# EAGLE design T245Controller_rev1 (EAGLE 9.6.1)

## Sheet 1 of 2
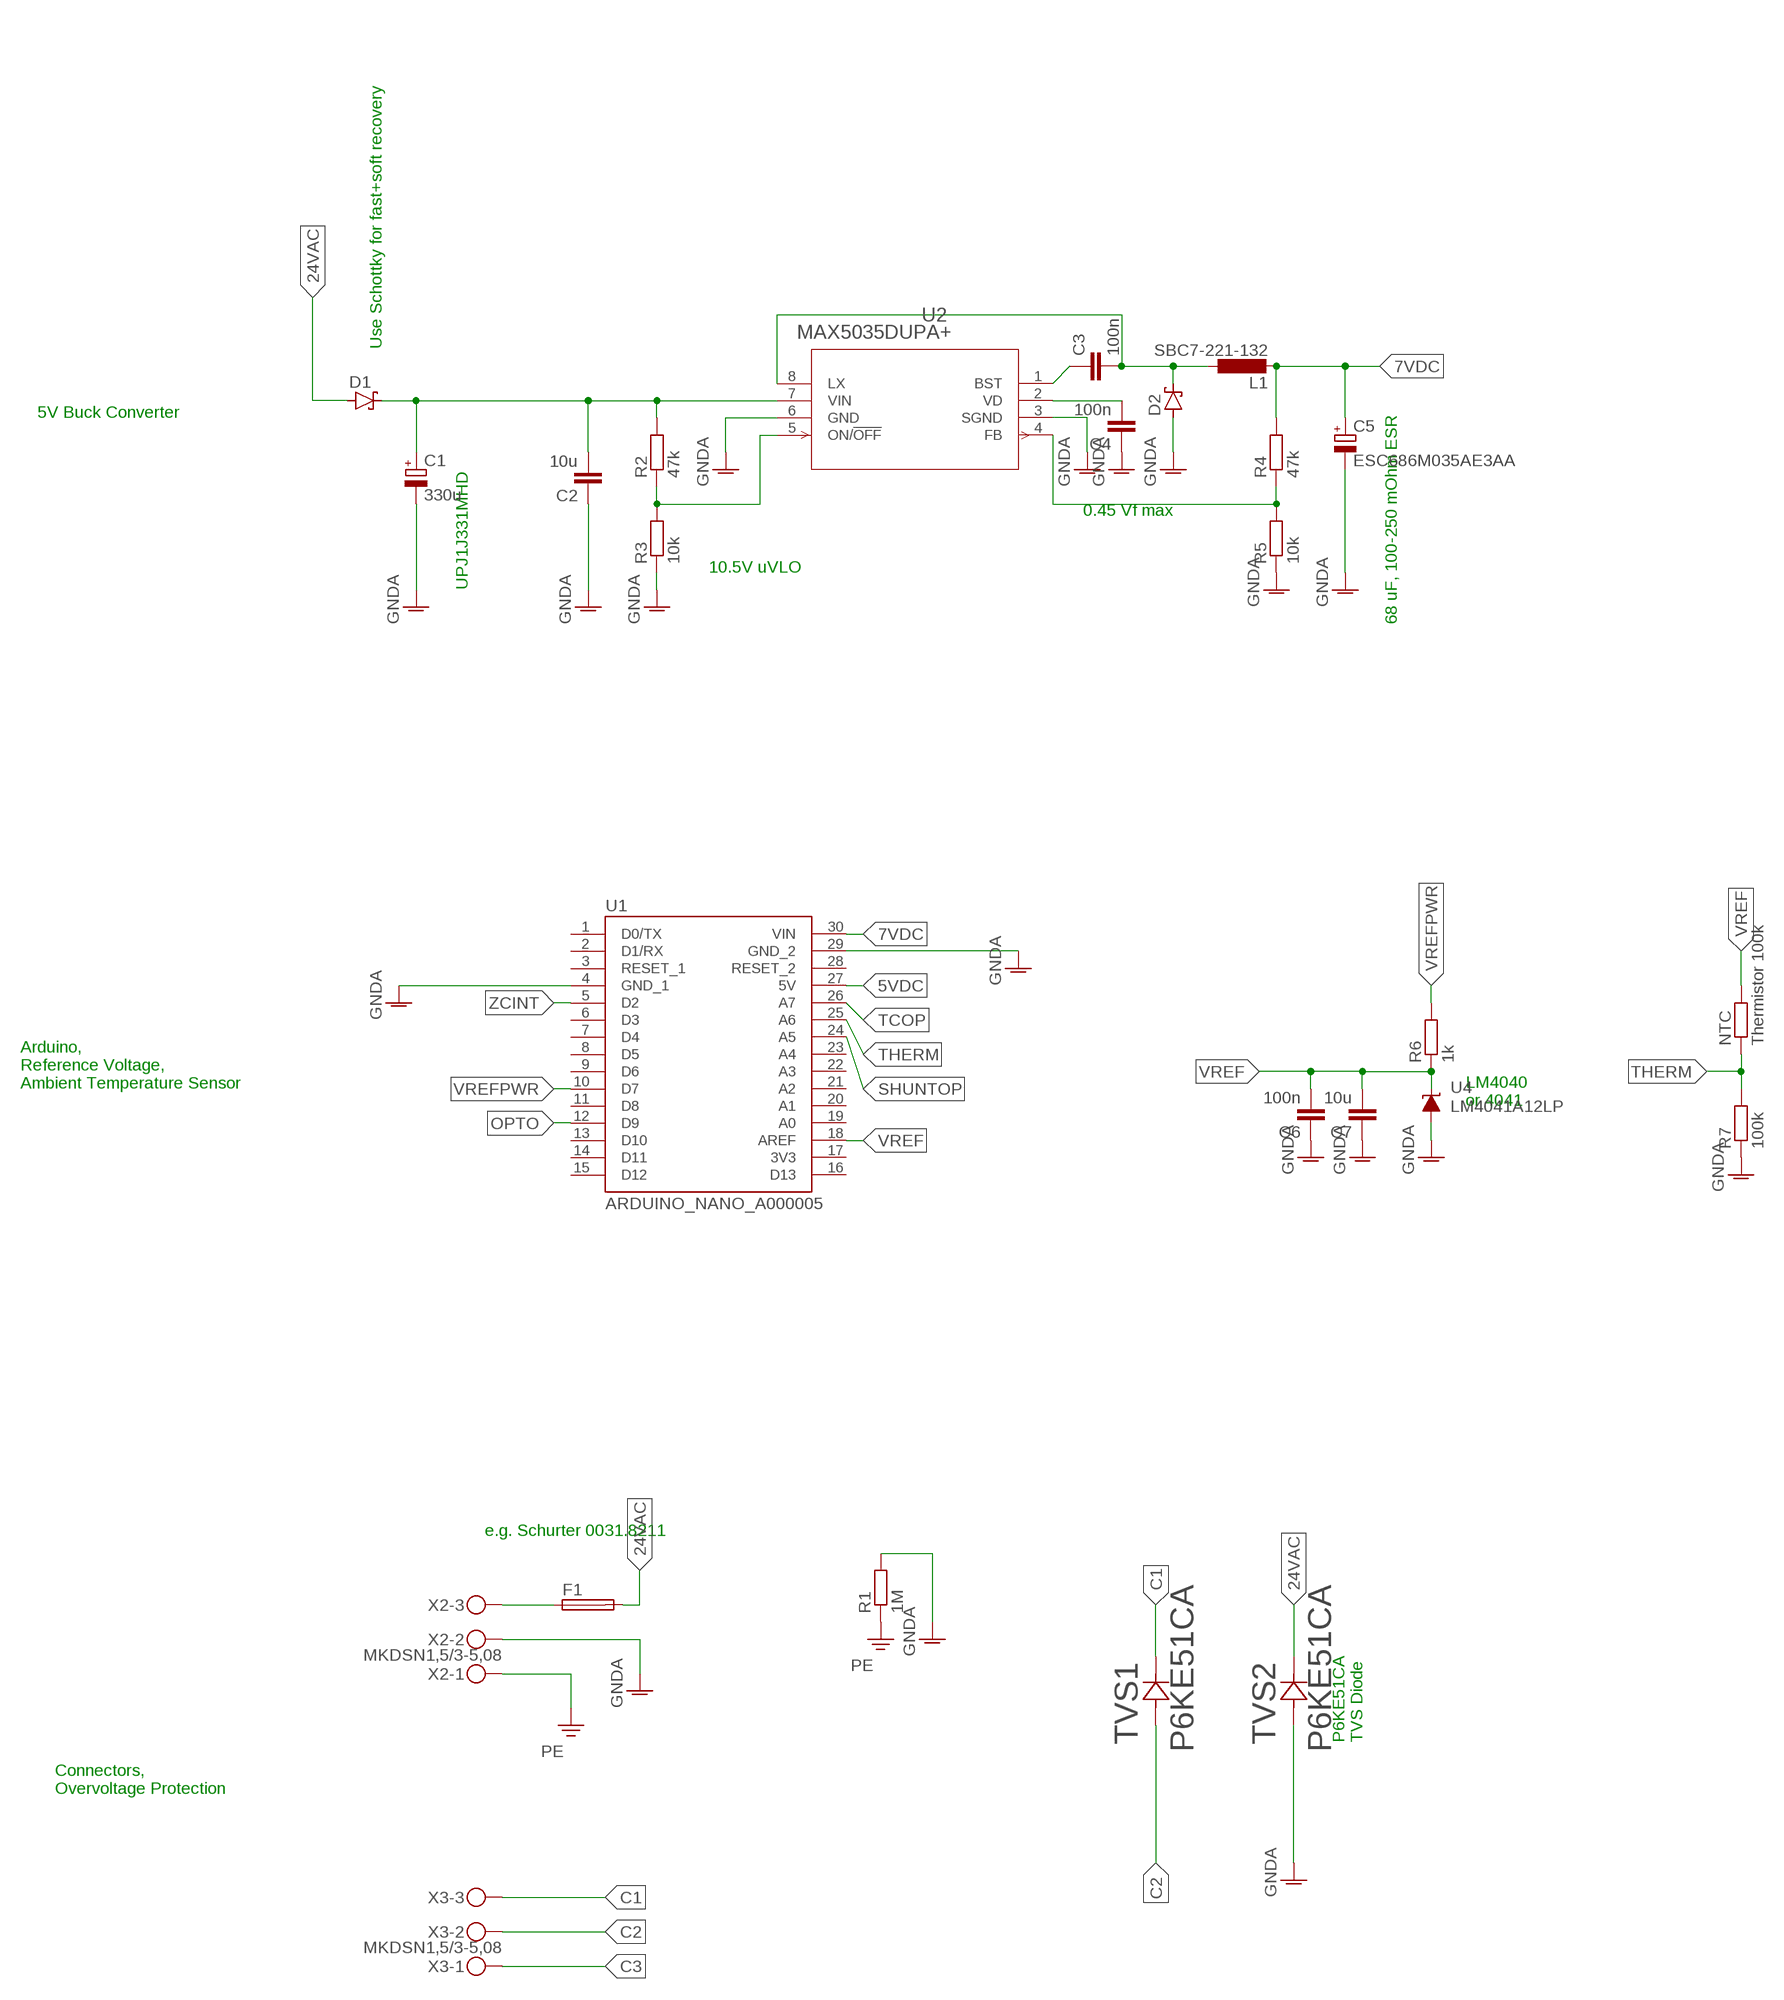
[diagram p0: schematic, sheet 1, part 1 of 2]
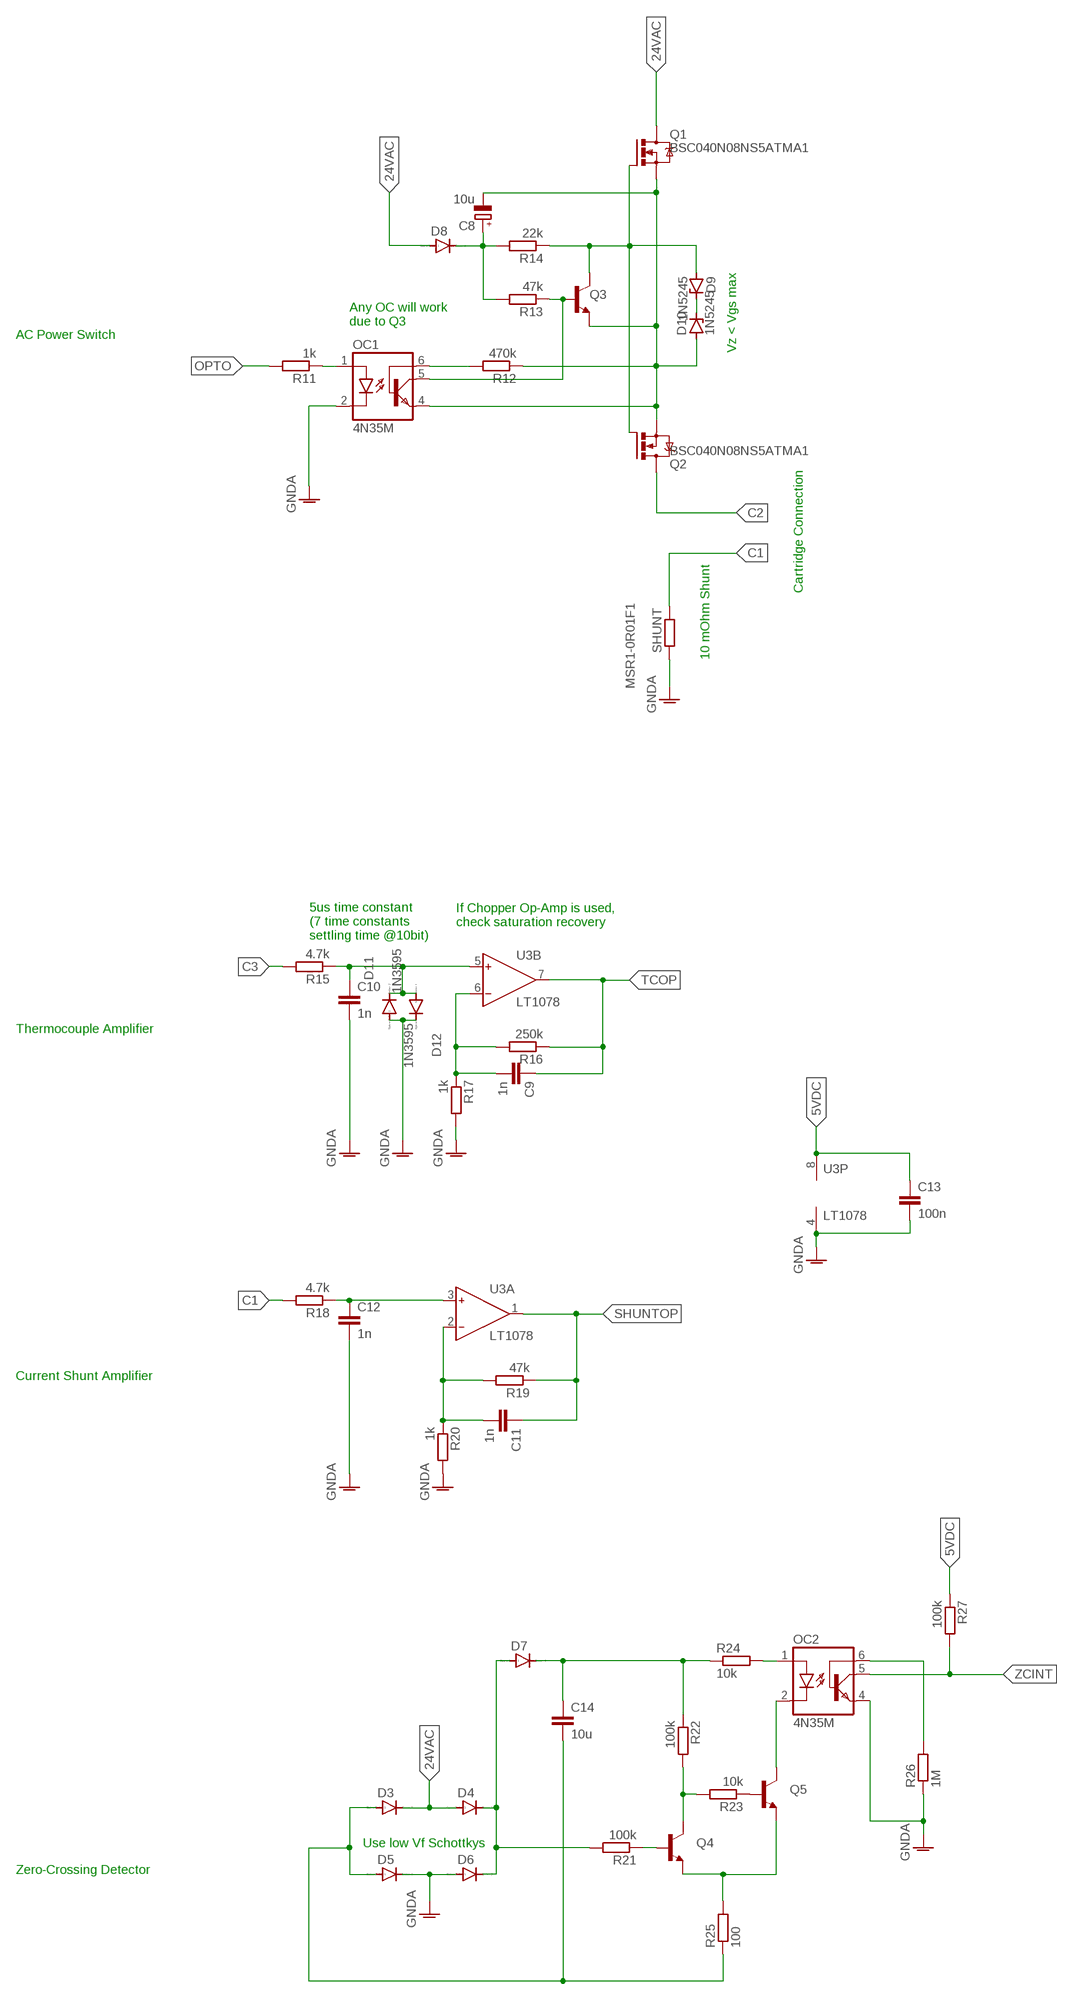
[diagram p1: schematic, sheet 1, part 2 of 2]

### Parts
C1  330u  CPOL-EUE5-13  [E5-13]
C2  10u  C-EU050-024X044  [C050-024X044]
C3  100n  C-EU050-024X044  [C050-024X044]
C4  100n  C-EU050-024X044  [C050-024X044]
C5  ESC686M035AE3AA  CPOL-EUE2.5-6  [E2,5-6]
C6  100n  C-EU050-024X044  [C050-024X044]
C7  10u  C-EU050-024X044  [C050-024X044]
C8  10u  CPOL-EUE2.5-6  [E2,5-6]
C9  1n  C-EU050-024X044  [C050-024X044]
C10  1n  C-EU050-024X044  [C050-024X044]
C11  1n  C-EU050-024X044  [C050-024X044]
C12  1n  C-EU050-024X044  [C050-024X044]
C13  100n  C-EU050-024X044  [C050-024X044]
C14  10u  C-EU050-024X044  [C050-024X044]
D1  SCHOTTKY-DIODEF126Z12  [F126Z12]
D2  SCHOTTKY-DIODEF126Z12  [F126Z12]
D3  DIODE-D-7.5  [D-7.5]
D4  DIODE-D-7.5  [D-7.5]
D5  DIODE-D-7.5  [D-7.5]
D6  DIODE-D-7.5  [D-7.5]
D7  DIODE-D-7.5  [D-7.5]
D8  DIODE-D-7.5  [D-7.5]
D9  1N5245  ZENER-DIODEDO41Z10  [DO41Z10]
D10  1N5245  ZENER-DIODEDO41Z10  [DO41Z10]
D11  1N3595  DIODE-D-7.5  [D-7.5]
D12  1N3595  DIODE-D-7.5  [D-7.5]
F1  SH22,5A  [SH22,5A]
L1  SBC7-221-132  L-EU0207/10  [0207/10]
NTC  Thermistor 100k  R-EU_0207/10  [0207/10]
OC1  4N35M  [DIL06]
OC2  4N35M  [DIL06]
Q1  BSC040N08NS5ATMA1  IRF540  [TO220BV]
Q2  BSC040N08NS5ATMA1  IRF540  [TO220BV]
Q3  2N5550-NPN-TO92-EBC  [TO92-EBC]
Q4  2N5550-NPN-TO92-EBC  [TO92-EBC]
Q5  2N5550-NPN-TO92-EBC  [TO92-EBC]
R1  1M  R-EU_0207/10  [0207/10]
R2  47k  R-EU_0207/10  [0207/10]
R3  10k  R-EU_0207/10  [0207/10]
R4  47k  R-EU_0207/10  [0207/10]
R5  10k  R-EU_0207/10  [0207/10]
R6  1k  R-EU_0207/10  [0207/10]
R7  100k  R-EU_0207/10  [0207/10]
R11  1k  R-EU_0207/10  [0207/10]
R12  470k  R-EU_0207/10  [0207/10]
R13  47k  R-EU_0207/10  [0207/10]
R14  22k  R-EU_0207/10  [0207/10]
R15  4.7k  R-EU_0207/10  [0207/10]
R16  250k  R-EU_0207/10  [0207/10]
R17  1k  R-EU_0207/10  [0207/10]
R18  4.7k  R-EU_0207/10  [0207/10]
R19  47k  R-EU_0207/10  [0207/10]
R20  1k  R-EU_0207/10  [0207/10]
R21  100k  R-EU_0207/10  [0207/10]
R22  100k  R-EU_0207/10  [0207/10]
R23  10k  R-EU_0207/10  [0207/10]
R24  10k  R-EU_0207/10  [0207/10]
R25  100  R-EU_0207/10  [0207/10]
R26  1M  R-EU_0207/10  [0207/10]
R27  100k  R-EU_0207/10  [0207/10]
SHUNT  MSR1-0R01F1  R-EU_0207/12  [0207/12]
TVS1  P6KE51CA  [P6KESERIES_LTF]
TVS2  P6KE51CA  [P6KESERIES_LTF]
U1  ARDUINO_NANO_A000005  [MODULE_A000005]
U2  MAX5035DUPA+  [21-0043_P8+3_MXM]
U3  LT1078  AD8066N  [DIL08]
U4  LM4041A12LP  [LP_O-PBCY-W3]
X2  MKDSN1,5/3-5,08  [MKDSN1,5/3-5,08]
X3  MKDSN1,5/3-5,08  [MKDSN1,5/3-5,08]

### Nets
5VDC: C13.1 R27.1 U1.27(5V) U3.8(P:V+)
7VDC: C5.+ L1.2 R4.2 U1.30(VIN)
24VAC: D1.A D3.C D4.A D8.A F1.2 Q1.D TVS2.1
C1: R18.2 SHUNT.2 TVS1.1 X3.3
C2: Q2.D TVS1.2 X3.2
C3: R15.2 X3.1
GNDA: C1.- C2.1 C4.1 C5.- C6.1 C7.1 C10.2 C12.2 C13.2 D2.A D5.C D6.A D11.A D12.C OC1.2(C) OC2.4(EMI) R1.2 R3.1 R5.1 R7.1 R17.2 R20.2 R26.1 SHUNT.1 TVS2.2 U1.4(GND_1) U1.29(GND_2) U2.3(SGND) U2.6(GND) U3.4(P:V-) U4.3(A) X2.2
N$1: C9.2 R16.2 R17.1 U3.6(B:IN-)
N$2: OC1.1(A) R11.1
N$3: D9.A Q1.G Q2.G Q3.C R14.1
N$4: C8.- D10.A OC1.4(EMI) Q1.S Q2.S Q3.E R12.1
N$5: OC1.6(BAS) R12.2
N$6: Q5.B R23.1
N$7: R4.1 R5.2 U2.4(FB)
N$8: C3.2 D2.C L1.1 U2.8(LX)
N$9: C8.+ D8.C R13.2 R14.2
N$10: C1.+ C2.2 D1.C R2.2 U2.7(VIN)
N$11: C10.1 D11.C D12.A R15.1 U3.5(B:IN+)
N$12: C3.1 U2.1(BST)
N$13: OC1.5(COL) Q3.B R13.1
N$16: D9.C D10.C
N$17: R2.1 R3.2 U2.5(ON/!OFF)
N$18: C4.2 U2.2(VD)
N$21: C14.2 D3.A D5.A R25.1
N$22: OC2.6(BAS) R26.2
N$24: F1.1 X2.3
N$25: C12.1 R18.1 U3.3(A:IN+)
N$26: D4.C D6.C D7.A R21.2
N$27: C11.2 R19.2 R20.1 U3.2(A:IN-)
N$28: Q4.B R21.1
N$29: C14.1 D7.C R22.1 R24.1
N$30: Q4.C R22.2 R23.2
N$31: Q4.E Q5.E R25.2
N$32: OC2.1(A) R24.2
N$33: OC2.2(C) Q5.C
OPTO: R11.2 U1.12(D9)
PE: R1.1 X2.1
SHUNTOP: C11.1 R19.1 U1.24(A5) U3.1(A:OUT)
TCOP: C9.1 R16.1 U1.26(A7) U3.7(B:OUT)
THERM: NTC.1 R7.2 U1.25(A6)
VREF: C6.2 C7.2 NTC.2 R6.1 U1.18(AREF) U4.2(C)
VREFPWR: R6.2 U1.10(D7)
ZCINT: OC2.5(COL) R27.2 U1.5(D2)
Unconnected: U1.1(D0/TX) U1.2(D1/RX) U1.3(RESET_1) U1.6(D3) U1.7(D4) U1.8(D5) U1.9(D6) U1.11(D8) U1.13(D10) U1.14(D11) U1.15(D12) U1.16(D13) U1.19(A0) U1.20(A1) U1.21(A2) U1.22(A3) U1.23(A4) U1.28(RESET_2)

### Notes on the sheet
- Use Schottky for fast+soft recovery
- 5V Buck Converter
- 0.45 Vf max
- 10.5V uVLO
- UPJ1J331MHD
- 68 uF, 100-250 mOhm ESR
- Arduino,
  Reference Voltage,
  Ambient Temperature Sensor
- LM4040
  or 4041
- e.g. Schurter 0031.8211
- P6KE51CA
  TVS Diode
- Connectors,
  Overvoltage Protection
- Any OC will work
  due to Q3
- AC Power Switch
- Vz < Vgs max
- Cartridge Connection
- 10 mOhm Shunt
- If Chopper Op-Amp is used,
  check saturation recovery
- 5us time constant
  (7 time constants 
  settling time @10bit)
- Thermocouple Amplifier
- Current Shunt Amplifier
- Use low Vf Schottkys
- Zero-Crossing Detector

## Sheet 2 of 2

## Power pins joined to a net without a drawn wire
3V3: U1.17(3V3)

## Library data of the parts
C1 C5 C8 = rcl:CPOL-EU: POLARIZED CAPACITOR, European symbol; SPICEPREFIX: C
C2-C4 C6 C7 C9-C14 = rcl:C-EU: CAPACITOR, European symbol; SPICEPREFIX: C
D1 D2 = diode:SCHOTTKY-DIODE: Schottky Diode
D3-D8 D11 D12 = diode:DIODE-: DIODE
D9 D10 = diode:ZENER-DIODE: Z-Diode
F1 = fuse:SH22,5A: FUSE HOLDER grid 22,5mm, isolated cap OGN0031 8201, Schurter (Buerklin); MPN: 0031.7701.11; OC_FARNELL: unknown; OC_NEWARK: 04F1224
L1 = rcl:L-EU: INDUCTOR, European symbol; SPICEPREFIX: L
NTC R1-R7 R11-R27 SHUNT = rcl:R-EU_: RESISTOR, European symbol; SPICEPREFIX: R
OC1 OC2 = optocoupler:4N*?M: General Purpose 6-Pin Phototransistor Optocouplers Source: http://www.fairchildsemi.com/ds/4N/4N35-M.pdf; MPN: 4N35-M; OC_FARNELL: 1021351; OC_NEWARK: 98K9114
Q1 Q2 = transistor-power:IRF540: HEXFET Power MOSFET
Q3-Q5 = transistor-neu-to92:*-NPN-: NPN Transistror
TVS1 TVS2 = P6KE51CA:P6KE51CA; BUILT_BY: EMA_UL_Team; MANUFACTURER_PART_NUMBER: P6KE51CA; SOURCELIBRARY: LittleFuse_2015-04-13; VENDOR: Littelfuse Inc
U1 = Arduino_Nano_A000005:ARDUINO_NANO_A000005; AVAILABILITY: In Stock; DESCRIPTION: ATmega328 Arduino Nano AVR® ATmega AVR MCU 8-Bit Embedded Evaluation Board; MF: Arduino; MP: A000005; PACKAGE: None; PRICE: None
U2 = MAX5035-DUPA:MAX5035DUPA+; BUILT_BY: EMA_UL_Team; MANUFACTURER_PART_NUMBER: max5035dupa+; REVISION: 1; SOURCELIBRARY: Update_to_database_2021-03-24; VENDOR: Maxim Integrated Products
U3 = analog-devices:AD8066: High Performance, 145 MHz FastFET Op Amps Source: http://www.analog.com/static/imported-files/data_sheets/AD8065_8066.pdf; OC_FARNELL: unknown; OC_NEWARK: unknown
U4 = texas:LM4041: PRECISION MICROPOWER SHUNT VOLTAGE REFERENCE Source: http://focus.ti.com/lit/ds/slcs146e/slcs146e.pdf; OC_FARNELL: 9486119; OC_NEWARK: unknown
X2 X3 = con-phoenix-508:MKDSN1,5/3-5,08: MKDSN 1,5/ 3-5,08 Printklemme Nennstrom: 13,5 A Nennspannung: 250 V Rastermaß: 5,08 mm Polzahl: 3 Anschlussart: Schraubanschluss Montage: Löten Anschlussrichtung Leiter/Platine: 0 ° Artikelnummer: 1729131 Source: http://eshop.phoenixcontact.com .. 1729131.pdf

## Board
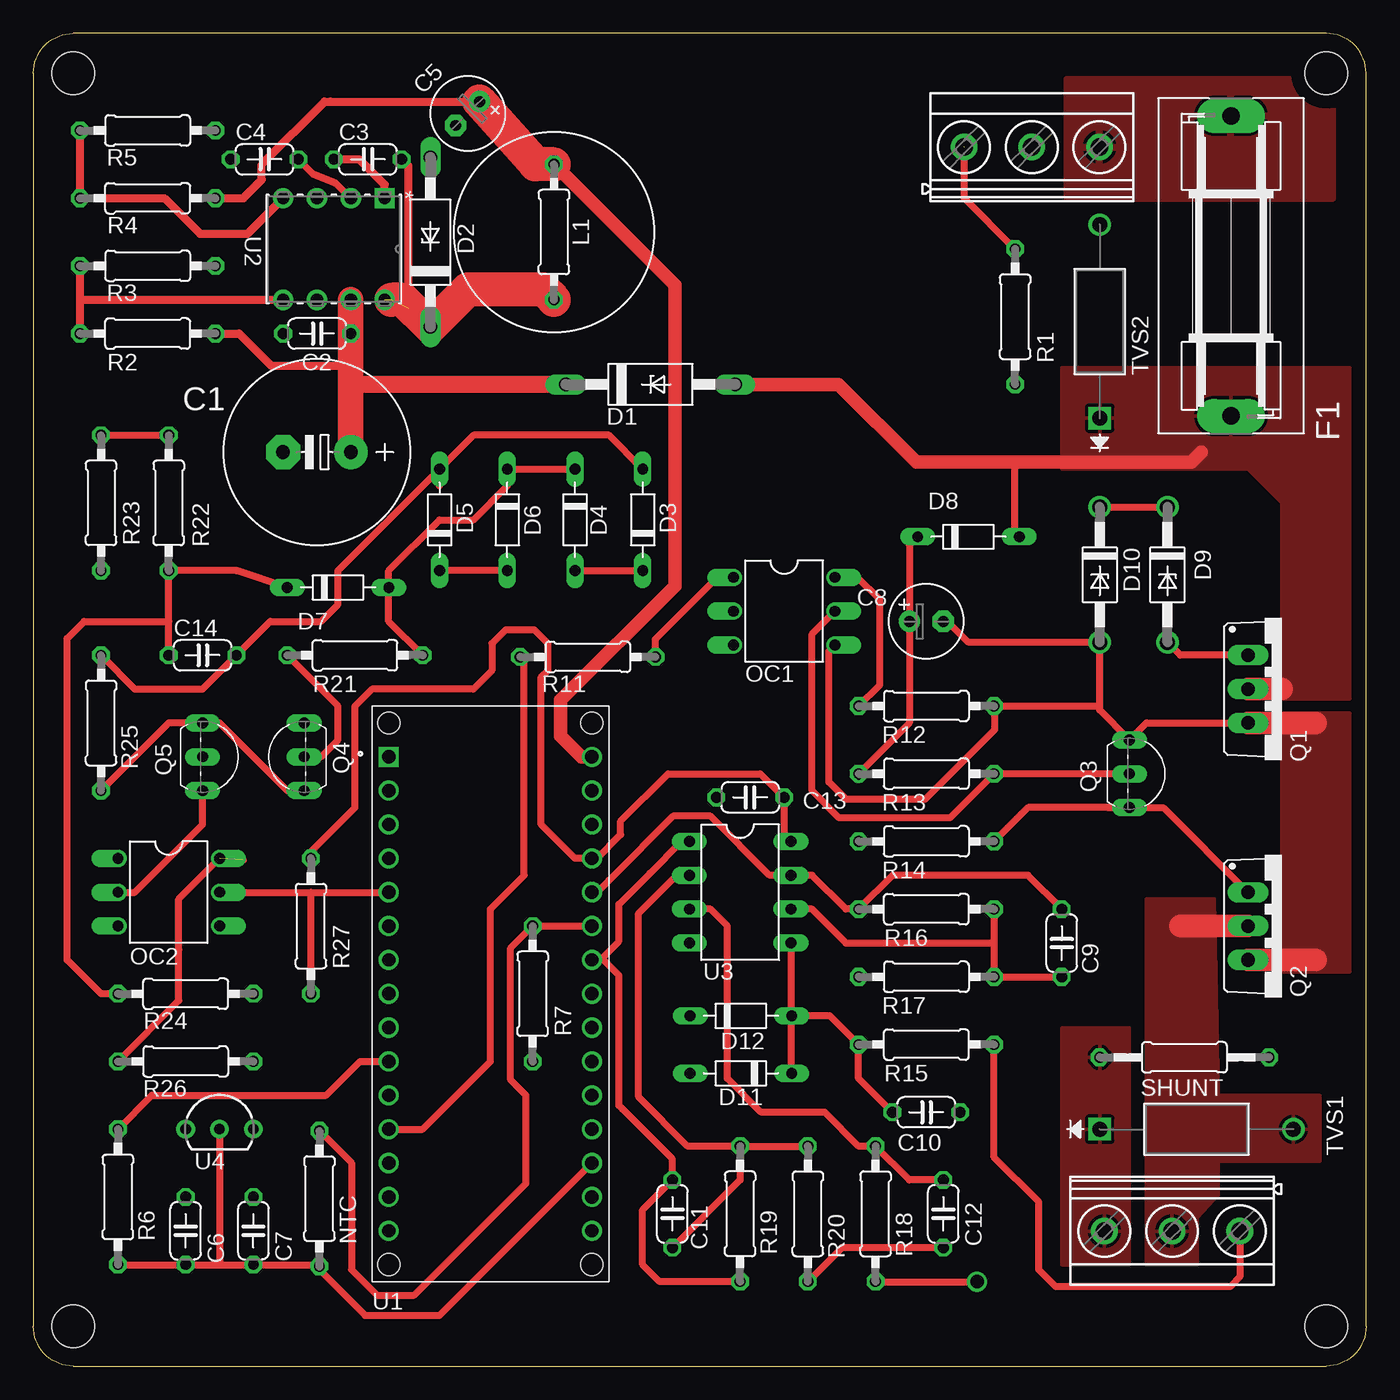
[diagram p2: board, top side]
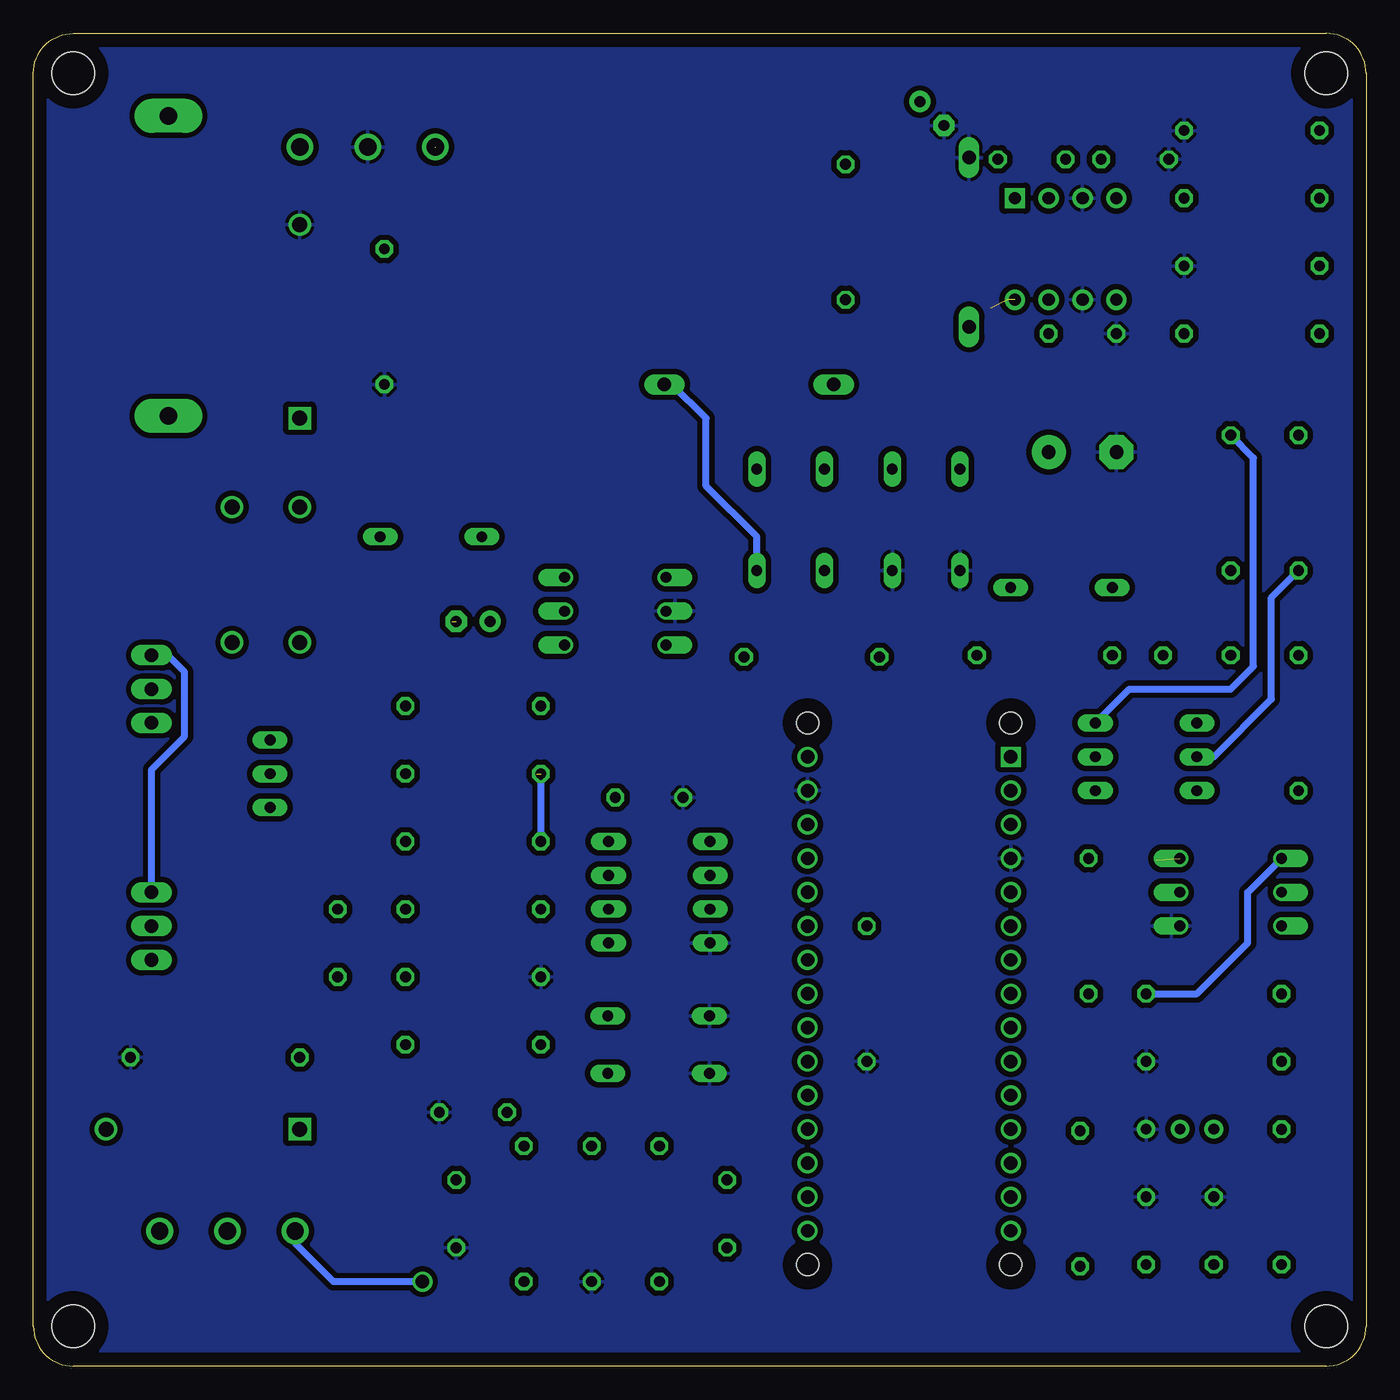
[diagram p3: board, bottom side, seen from below]

Size 100 x 100 mm. Coordinates in mm from the lower left corner, seen from the top.
Outline: 3,0 97,0 arc90 100,3 100,97 arc90 97,100 3,100 arc90 0,97 0,3 arc90 3,0
Copper layers (1*16): Top 0.035mm / dielectric 1.5mm / Bottom 0.035mm
Design rules "default *": minimum track width 6mil, minimum drill 0.35mm, track to track 16mil, track to pad 16mil, pad to pad 16mil, via to via 16mil, smd to smd 16mil, copper to edge 40mil, drill to drill 6mil, minimum pad ring 10mil, minimum via ring 8mil, stop-mask expansion 4mil, vias tented up to drill 0mil, thermal gap 10mil
Holes 3.2 mm at 3,97 3,3 97,97 97,3

### Footprints (pad centres in the part's own frame; a part is rotated, then mirrored left to right if it is on the bottom)
E5-13 = drill 1.016 pad 2.54: + -2.54,0 | drill 1.016 pad 2.54 octagon: - 2.54,0
C050-024X044 = drill 0.813 octagon: 1 -2.54,0; 2 2.54,0
E2,5-6 = drill 0.813 pad 1.6: + -1.27,0 | drill 0.813 pad 1.6 octagon: - 1.27,0
F126Z12 = drill 1.016 long: A 6.35,0; C -6.35,0
D-7.5 = drill 0.813 long: A 3.81,0; C -3.81,0
DO41Z10 = drill 1.118: A 5.08,0; C -5.08,0
SH22,5A = drill 1.321 pad 2.54 long: 1 -11.252,0; 2 11.252,0
0207/10 = drill 0.813 octagon: 1 -5.08,0; 2 5.08,0
DIL06 = drill 0.813 offset: 1 -2.54,-3.81; 2 0,-3.81; 3 2.54,-3.81; 4 2.54,3.81; 5 0,3.81; 6 -2.54,3.81
TO220BV = drill 1.016 long: D 0,-2.54; G -2.54,-2.54; S 2.54,-2.54
TO92-EBC = drill 0.813 long: B 0,-1.27; C 2.54,-1.27; E -2.54,-1.27
0207/12 = drill 0.813 octagon: 1 -6.35,0; 2 6.35,0
P6KESERIES_LTF = drill 1.118 pad 1.626 square: 1 0,0 | drill 1.118 pad 1.626: 2 14.529,0
MODULE_A000005 = drill 1 square: 1 -7.62,17.78 | drill 1: 2 -7.62,15.24; 3 -7.62,12.7; 4 -7.62,10.16; 5 -7.62,7.62; 6 -7.62,5.08; 7 -7.62,2.54; 8 -7.62,0; 9 -7.62,-2.54; 10 -7.62,-5.08; 11 -7.62,-7.62; 12 -7.62,-10.16; 13 -7.62,-12.7; 14 -7.62,-15.24; 15 -7.62,-17.78; 16 7.62,-17.78; 17 7.62,-15.24; 18 7.62,-12.7; 19 7.62,-10.16; 20 7.62,-7.62; 21 7.62,-5.08; 22 7.62,-2.54; 23 7.62,0; 24 7.62,2.54; 25 7.62,5.08; 26 7.62,7.62; 27 7.62,10.16; 28 7.62,12.7; 29 7.62,15.24; 30 7.62,17.78 | hole 1.651: -7.62,-20.32; 7.62,-20.32; -7.62,20.32; 7.62,20.32
21-0043_P8+3_MXM = drill 0.914 pad 1.524 square: 1 0,0 | drill 0.914 pad 1.524: 2 0,-2.54; 3 0,-5.08; 4 0,-7.62; 5 7.62,-7.62; 6 7.62,-5.08; 7 7.62,-2.54; 8 7.62,0
DIL08 = drill 0.813 long: 1 -3.81,-3.81; 2 -1.27,-3.81; 3 1.27,-3.81; 4 3.81,-3.81; 5 3.81,3.81; 6 1.27,3.81; 7 -1.27,3.81; 8 -3.81,3.81
LP_O-PBCY-W3 = drill 0.8 pad 1.4: 1 -2.54,0; 2 0,0; 3 2.54,0
MKDSN1,5/3-5,08 = drill 1.3 pad 2: 1 -7.641,0.025; 2 -2.561,0.025; 3 2.519,0.025

### Placement (x,y rotation side)
C1  21.28,68.58 180 top
C2  21.28,77.47 0 top
C3  25.09,90.55 0 top
C4  17.34,90.55 0 top
C5  32.58,93.98 225 top
C6  11.43,10.16 270 top
C7  16.51,10.16 270 top
C8  67,55.88 0 top
C9  77.16,31.75 270 top
C10  67,19.05 0 top
C11  47.95,11.43 270 top
C12  68.27,11.43 270 top
C13  53.79,42.67 180 top
C14  12.7,53.34 0 top
D1  46.3,73.66 0 top
D2  29.79,84.33 90 top
D3  45.72,63.5 90 top
D4  40.64,63.5 270 top
D5  30.48,63.5 90 top
D6  35.56,63.5 270 top
D7  22.86,58.42 0 top
D8  70.16,62.23 0 top
D9  85.09,59.38 270 top
D10  80.01,59.38 270 top
D11  53.09,21.97 180 top
D12  53.09,26.29 0 top
F1  89.86,82.55 270 top
L1  39.06,85.09 90 top
NTC  21.46,12.57 270 top
OC1  56.33,56.64 270 top
OC2  10.16,35.56 270 top
Q1  93.67,50.8 270 top
Q2  93.67,33.02 270 top
Q3  83.51,44.45 270 top
Q4  19.05,45.72 90 top
Q5  13.97,45.72 270 top
R1  73.66,78.74 270 top
R2  8.58,77.47 0 top
R3  8.58,82.55 180 top
R4  8.58,87.63 0 top
R5  8.58,92.71 180 top
R6  6.35,12.7 90 top
R7  37.47,27.94 90 top
R11  41.6,53.21 180 top
R12  67,49.53 180 top
R13  67,44.45 180 top
R14  67,39.37 180 top
R15  67,24.13 0 top
R16  67,34.29 0 top
R17  67,29.21 180 top
R18  63.19,11.43 270 top
R19  53.03,11.43 90 top
R20  58.11,11.43 270 top
R21  24.13,53.34 0 top
R22  10.16,64.77 90 top
R23  5.08,64.77 90 top
R24  11.43,27.94 0 top
R25  5.08,48.26 270 top
R26  11.43,22.86 180 top
R27  20.83,33.02 270 top
SHUNT  86.36,23.17 180 top
TVS1  80.01,17.78 0 top
TVS2  80.01,71.12 90 top
U1  34.29,27.94 0 top
U2  26.36,87.63 270 top
U3  53.03,35.56 270 top
U4  13.97,17.78 0 top
X2  77.47,91.44 0 top
X3  82.88,10.16 180 top

### Tracks (layer width: path | path; a pad name or v marks a point on that pad's centre or on a via)
5VDC
  Top 0.508: R27.1 20.83,38.61 24.13,41.91 24.13,49.53 25.4,50.8 33.02,50.8 34.42,52.2 34.42,54.23 35.43,55.24 37.59,55.24 38.61,54.23 38.61,52.2 38.1,51.69 38.1,40.64 40.64,38.1 U1.27 42.29,38.1 44.07,39.88 44.07,40.89 47.62,44.45 54.55,44.45 C13.1 56.33,39.88 U3.8
7VDC
  Top 0.61: C5.+ 22.3,94.88 21.85,94.88 17.14,90.17 17.14,89.03 15.75,87.63 R4.2
  Top 1.016: L1.2 48.13,81.1 48.13,58.55 39.56,49.97 39.56,47.29 41.13,45.72 U1.30
  Top 2.54: L1.2 37.66,90.17 C5.+
24VAC
  Top 0.508: D4.A D3.C | D8.A 73.66,62.54 73.66,67.82
  Top 1.016: 87.63,68.58 86.87,67.82 73.66,67.82 66.24,67.82 60.4,73.66 D1.A
  Top 1.7: Q1.D 93.67,50.8
  Bottom 0.508: D3.C 45.72,62.23 49.53,66.04 49.53,71.12 52.07,73.66 D1.A
  Bottom 1.016: D1.A 52.78,73.79
  pour Top: 77.16,74.93 98.75,74.93 98.75,50.04 93.67,50.04 93.67,64.77 91.13,67.31 77.16,67.31
C1  (via drill 1)
  Top 0.508: R18.2 v70.81,6.35
  Bottom 0.508: X3.3 80.36,9.24 77.47,6.35 v70.81,6.35
  pour Top: 77.16,25.4 82.24,25.4 82.24,7.62 77.16,7.62
C2
  Top 1.7: Q2.D 86.05,33.02
  pour Top: 83.51,7.62 83.51,24.12 83.52,35.05 88.59,35.05 88.9,20.32 96.52,20.32 96.52,15.37 88.9,15.37 88.9,12.83 88.52,12.45 87.32,11.12 87.32,7.62
C3
  Top 0.508: X3.1 90.52,6.7 89.79,5.97 76.71,5.97 75.44,7.24 75.44,12.32 72.08,15.68 R15.2
GNDA
  Top 0.508: R20.2 60.65,8.89 C12.2 | D6.A D5.C
  pour Bottom: -4.12,102.87 103.83,102.87 103.83,-3.81 -4.12,-3.81
N$1
  Top 0.508: R16.2 72.08,31.75 | 72.08,31.75 R17.1 C9.2 | U3.6 58.42,34.29 60.96,31.75 72.08,31.75
N$2
  Top 0.508: 46.68,53.34 R11.1 46.68,54.55 51.31,59.18 OC1.1
N$3
  Top 0.508: Q3.C 84.78,41.91 Q2.G | 80.59,41.91 Q3.C | Q1.G 86.05,53.34 D9.A | Q3.C 74.62,41.91 R14.1
  Bottom 0.508: Q2.G 91.13,44.76 88.65,47.24 88.65,52.07 89.92,53.34 Q1.G
N$4  (1 unrouted)
  Top 0.508: 68.27,55.5 C8.- | Q1.S 83.51,48.26 Q3.E 80.01,49.22 80.01,49.53 | 68.58,55.88 70.16,54.3 D10.A 80.01,49.53 | 80.01,49.53 R12.1 72.14,49.47 72.14,47.75 66.93,42.55 60.96,42.55 59.69,43.81 59.69,53.65 OC1.4
  Top 1.7: 91.64,48.26 Q1.S 96.21,48.26 | Q2.S 96.21,30.48
  pour Top: 93.67,49.02 93.67,29.59 98.75,29.59 98.75,49.02
N$5
  Top 0.508: R12.2 63.5,51.11 63.5,57.53 61.85,59.18 OC1.6
N$6
  Bottom 0.508: Q5.B 11.43,45.72 7.11,50.04 7.11,57.66 R23.1
N$7
  Top 0.61: R5.2 R4.1 9.85,87.63 12.52,84.96 16.07,84.96 U2.4
N$8  (2 unrouted)
  Top 0.61: 28.14,79.38 28.14,90.04 C3.2
  Top 2.54: L1.1 38.3,80.77 32.58,80.77 D2.C 27.76,80.01 26.87,80.01
N$9  (via drill 0.35)  (1 unrouted)
  Top 0.508: v61.92,44.14 62.23,44.45 | R13.2 65.73,48.26 C8.+ 65.73,61.61 D8.C
  Bottom 0.508: R14.2 v61.92,44.14
N$10
  Top 0.61: R2.2 15.44,77.47 17.85,75.06 23.82,75.06
  Top 1.27: D1.C 23.82,73.66
  Top 1.905: C1.+ 23.82,73.66 23.82,75.06 C2.2 U2.7
N$11
  Top 0.508: D11.C D12.A | D12.A 56.9,31.69 U3.5 | D12.A 59.76,26.29 R15.1 61.92,21.59 C10.1
N$12
  Top 0.61: U2.1 26.36,88.65 24.45,90.55 C3.1
N$13
  Top 0.508: 81.22,44.45 Q3.B R13.1 68.78,41.15 60.45,41.15 58.42,43.18 58.42,54.92 OC1.5
N$16
  Top 0.508: D10.C D9.C
N$17
  Top 0.61: R2.1 3.5,80.01 | 3.5,80.01 R3.2 | 3.5,80.01 U2.5
N$18
  Top 0.508: 19.88,90.48 C4.2 21.03,89.41 21.08,89.41 22.68,88.77 | U2.2 22.68,88.77 | 22.68,88.77 22.61,88.77
N$21
  Top 0.508: R25.1 7.62,50.8 12.7,50.8 C14.2 17.78,55.88 21.59,55.88 22.86,57.15 22.86,59.69 D5.A | D3.A 43.18,69.85 33.02,69.85 D5.A | 30.48,66.04 D5.A
N$22  (1 unrouted)
  Top 0.508: 15.75,37.97 13.84,37.97 10.92,35.05 10.92,31.75 10.92,31.24 10.92,27.43 R26.2
N$24
  pour Top: 77.54,96.52 77.54,87.63 97.48,87.63 97.48,96.52
N$25
  Top 0.508: C12.1 65.73,13.97 R18.1 61.92,16.51 59.38,19.05 54.61,19.05 52.07,21.59 52.07,33.02 50.8,34.29 U3.3
N$26
  Top 0.508: D4.C D6.C 35.56,66.04 33.02,63.5 30.48,63.5 26.67,59.69 D7.A 26.67,55.88 R21.2
N$27
  Top 0.508: R19.2 53.03,13.97 C11.2 | R19.2 R20.1 | R19.2 49.09,16.51 45.41,20.19 45.41,33.98 48.26,36.83 U3.2
N$28
  Top 0.508: Q4.B 21.59,45.72 22.86,46.99 22.86,49.53 R21.1
N$29
  Top 0.508: C14.1 10.16,55.88 | 10.16,55.88 R22.1 15.24,59.69 D7.C | R24.1 5.08,27.94 2.54,30.48 2.54,54.61 3.81,55.88 10.16,55.88
N$30
  Top 0.508: R23.2 R22.2
  Bottom 0.508: Q4.C 17.78,50.8 10.16,50.8 8.46,52.5 8.46,68.15 R22.2
N$31
  Top 0.508: R25.2 10.16,48.26 Q5.E 13.97,48.26 19.05,43.18 Q4.E
N$32
  Bottom 0.508: R24.2 12.7,27.94 8.89,31.75 8.89,35.56 OC2.1 5.08,38.1
N$33
  Top 0.508: Q5.C 12.7,40.64 7.62,35.56 OC2.2
OPTO
  Top 0.508: U1.12 29.21,17.78 34.29,22.86 34.29,34.29 36.83,36.83 36.83,52.9 R11.2
PE  (1 unrouted)
  Top 0.508: 69.85,91.44 69.85,87.63 R1.1
SHUNTOP
  Top 0.508: R19.1 46.99,6.35 45.72,7.62 45.72,11.74 C11.1 47.95,15.55 44.45,19.05 44.2,19.3 43.94,19.56 43.94,29.34 42.8,30.48 42.55,30.48 | U1.24 42.29,30.48 42.55,30.48 | 42.55,30.48 43.94,31.88 43.94,34.65 46.25,36.96 46.25,36.98 48.64,39.37 U3.1
TCOP
  Top 0.508: C9.1 74.62,36.83 64.46,36.83 R16.1 60.96,34.29 58.42,36.83 U3.7 55.24,36.83 50.8,41.27 48.01,41.27 43.37,36.64 43.18,36.45 42.29,35.56 U1.26
THERM
  Top 0.508: NTC.1 23.88,15.24 23.88,7.24 25.78,5.33 28.57,5.33 36.96,13.72 36.96,20.32 35.81,21.46 35.81,31.37 R7.2 U1.25
VREF
  Top 0.508: R6.1 C6.2 13.97,7.62 | 13.97,7.62 C7.2 21.46,7.62 NTC.2 21.34,7.37 24.89,3.81 30.48,3.81 U1.18 | U4.2 13.97,7.62
VREFPWR
  Top 0.508: R6.2 8.89,20.32 21.97,20.32 24.51,22.86 U1.10
ZCINT
  Top 0.508: OC2.5 20.83,35.56 | 20.83,35.56 U1.5 | R27.2 20.83,35.56